# Altium schematic sheet connectors (1).SchDoc
size 431 x 279 mm; SheetNumber: 1; SheetTotal: 1
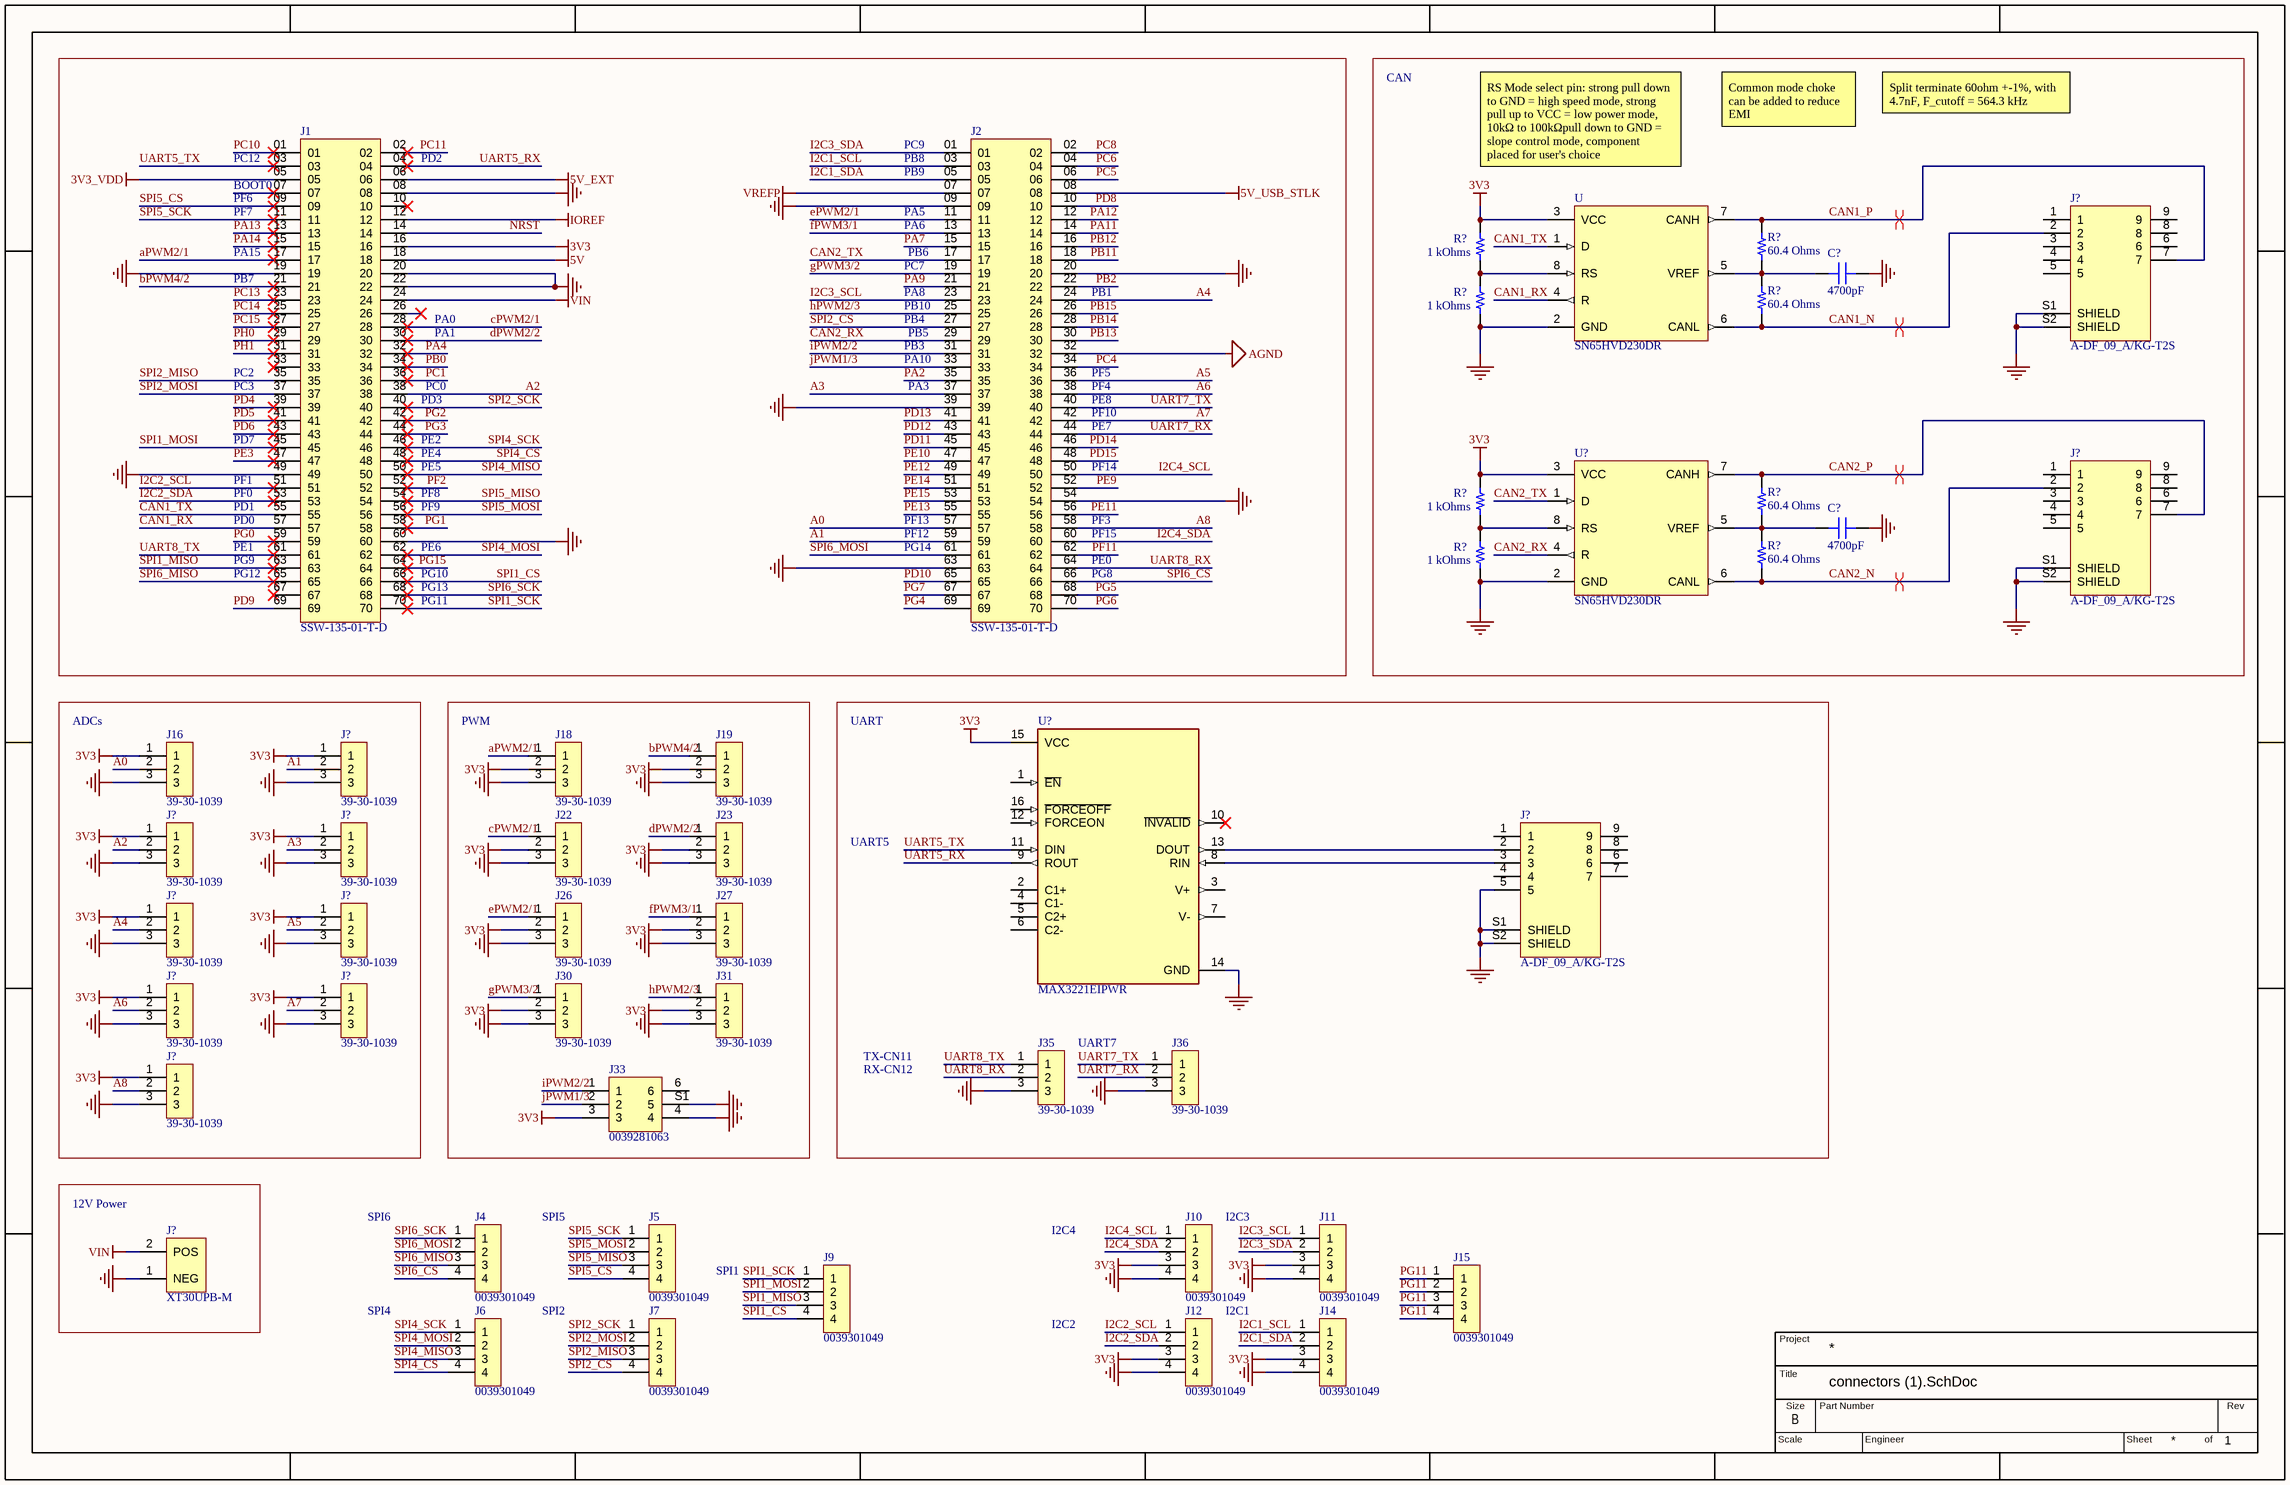
[diagram p0: connectors (1).SchDoc]

## Parts
(Parts that share a designator on the sheet are numbered #1, #2 ... from top to bottom, then left to right.)
C?#1  4700pF  [CAP 1206_3216 - 1.8MM]
C?#2  4700pF  [CAP 1206_3216 - 1.8MM]
J1  SSW-135-01-T-D  [SAMTEC_SSW-135-01-T-D]
J2  SSW-135-01-T-D  [SAMTEC_SSW-135-01-T-D]
J4  0039301049  [MOLEX_0039301049]
J5  0039301049  [MOLEX_0039301049]
J6  0039301049  [MOLEX_0039301049]
J7  0039301049  [MOLEX_0039301049]
J9  0039301049  [MOLEX_0039301049]
J10  0039301049  [MOLEX_0039301049]
J11  0039301049  [MOLEX_0039301049]
J12  0039301049  [MOLEX_0039301049]
J14  0039301049  [MOLEX_0039301049]
J15  0039301049  [MOLEX_0039301049]
J16  39-30-1039  [MOLEX_39-30-1039]
J18  39-30-1039  [MOLEX_39-30-1039]
J19  39-30-1039  [MOLEX_39-30-1039]
J22  39-30-1039  [MOLEX_39-30-1039]
J23  39-30-1039  [MOLEX_39-30-1039]
J26  39-30-1039  [MOLEX_39-30-1039]
J27  39-30-1039  [MOLEX_39-30-1039]
J30  39-30-1039  [MOLEX_39-30-1039]
J31  39-30-1039  [MOLEX_39-30-1039]
J33  0039281063  [MOLEX_0039281063]
J35  39-30-1039  [MOLEX_39-30-1039]
J36  39-30-1039  [MOLEX_39-30-1039]
J?#1  A-DF_09_A/KG-T2S  [ASSMANN_A-DF09A/KG-T2S]
J?#2  A-DF_09_A/KG-T2S  [ASSMANN_A-DF09A/KG-T2S]
J?#3  39-30-1039  [MOLEX_39-30-1039]
J?#4  39-30-1039  [MOLEX_39-30-1039]
J?#5  39-30-1039  [MOLEX_39-30-1039]
J?#6  A-DF_09_A/KG-T2S  [ASSMANN_A-DF09A/KG-T2S]
J?#7  39-30-1039  [MOLEX_39-30-1039]
J?#8  39-30-1039  [MOLEX_39-30-1039]
J?#9  39-30-1039  [MOLEX_39-30-1039]
J?#10  39-30-1039  [MOLEX_39-30-1039]
J?#11  39-30-1039  [MOLEX_39-30-1039]
J?#12  XT30UPB-M  [AMASS_XT30-M]
R?#1  1 kOhms  [RES 0805_2012]
R?#2  60.4 Ohms  [RES 0603_1608]
R?#3  1 kOhms  [RES 0805_2012]
R?#4  60.4 Ohms  [RES 0603_1608]
R?#5  1 kOhms  [RES 0805_2012]
R?#6  60.4 Ohms  [RES 0603_1608]
R?#7  1 kOhms  [RES 0805_2012]
R?#8  60.4 Ohms  [RES 0603_1608]
U  SN65HVD230DR  [SOIC127P599X175-8N]
U?#1  SN65HVD230DR  [SOIC127P599X175-8N]
U?#2  MAX3221EIPWR  [SOP65P640X120-16N]

## Blocks framed on the sheet
CAN: C?#1 C?#2 J?#1 J?#2 R?#1-R?#8 U U?#1
ADCs: J16 J?#3-J?#5 J?#7-J?#11
PWM: J18 J19 J22 J23 J26 J27 J30 J31 J33
12V Power: J?#12

## Nets
3V3: J1.16 J10.3 J11.3 J12.3 J14.3 J16.1 J18.2 J19.2 J22.2 J23.2 J26.2 J27.2 J30.2 J31.2 J33.3 J?#3.1 J?#4.1 J?#5.1 J?#7.1 J?#8.1 J?#9.1 J?#10.1 J?#11.1 R?#1.2 R?#5.2 U.3(VCC) U?#1.3(VCC) U?#2.15(VCC)
3V3_VDD: J1.05
5V: J1.18
5V_EXT: J1.06
5V_USB_STLK: J2.08
AGND: J2.32
GND: C?#1.2 C?#2.2 J1.08 J1.19 J1.20 J1.22 J1.49 J1.60 J2.09 J2.20 J2.39 J2.54 J2.63 J10.4 J11.4 J12.4 J14.4 J16.3 J18.3 J19.3 J22.3 J23.3 J26.3 J27.3 J30.3 J31.3 J33.4 J33.S1(5) J35.3 J36.3 J?#1.S1(SHIELD) J?#1.S2(SHIELD) J?#2.S1(SHIELD) J?#2.S2(SHIELD) J?#3.3 J?#4.3 J?#5.3 J?#6.5 J?#6.S1(SHIELD) J?#6.S2(SHIELD) J?#7.3 J?#8.3 J?#9.3 J?#10.3 J?#11.3 J?#12.1(NEG) R?#3.1 R?#7.1 U.2(GND) U?#1.2(GND) U?#2.14(GND)
IOREF: J1.12
VIN: J1.24 J?#12.2(POS)
VREFP: J2.07
A0: J2.57 J16.2
A1: J2.59 J?#3.2
A2: J1.38 J?#4.2
A3: J2.37 J?#5.2
A4: J2.24 J?#7.2
A5: J2.36 J?#8.2
A6: J2.38 J?#9.2
A7: J2.42 J?#10.2
A8: J2.58 J?#11.2
aPWM2/1: J1.17 J18.1
bPWM4/2: J1.21 J19.1
CAN1_N: J?#1.2 R?#4.2 U.6(CANL)
CAN1_P: J?#1.7 R?#2.1 U.7(CANH)
CAN1_RX: J1.57 U.4(R)
CAN1_TX: J1.55 U.1(D)
CAN2_N: J?#2.2 R?#8.2 U?#1.6(CANL)
CAN2_P: J?#2.7 R?#6.1 U?#1.7(CANH)
CAN2_RX: J2.29 U?#1.4(R)
CAN2_TX: J2.17 U?#1.1(D)
cPWM2/1: J1.28 J22.1
dPWM2/2: J1.30 J23.1
ePWM2/1: J2.11 J26.1
fPWM3/1: J2.13 J27.1
gPWM3/2: J2.19 J30.1
hPWM2/3: J2.25 J31.1
I2C1_SCL: J2.03 J14.1
I2C1_SDA: J2.05 J14.2
I2C2_SCL: J1.51 J12.1
I2C2_SDA: J1.53 J12.2
I2C3_SCL: J2.23 J11.1
I2C3_SDA: J2.01 J11.2
I2C4_SCL: J2.50 J10.1
I2C4_SDA: J2.60 J10.2
iPWM2/2: J2.31 J33.1
jPWM1/3: J2.33 J33.2
NRST: J1.14
PA2: J2.35
PA4: J1.32
PA7: J2.15
PA9: J2.21
PA11: J2.14
PA12: J2.12
PA13: J1.13
PA14: J1.15
PB0: J1.34
PB2: J2.22
PB11: J2.18
PB12: J2.16
PB13: J2.30
PB14: J2.28
PB15: J2.26
PC1: J1.36
PC4: J2.34
PC5: J2.06
PC6: J2.04
PC8: J2.02
PC10: J1.01
PC11: J1.02
PC13: J1.23
PC14: J1.25
PC15: J1.27
PD4: J1.39
PD5: J1.41
PD6: J1.43
PD8: J2.10
PD9: J1.69
PD10: J2.65
PD11: J2.45
PD12: J2.43
PD13: J2.41
PD14: J2.46
PD15: J2.48
PE3: J1.47
PE9: J2.52
PE10: J2.47
PE11: J2.56
PE12: J2.49
PE13: J2.55
PE14: J2.51
PE15: J2.53
PF2: J1.52
PF11: J2.62
PG0: J1.59
PG1: J1.58
PG2: J1.42
PG3: J1.44
PG4: J2.69
PG5: J2.68
PG6: J2.70
PG7: J2.67
PG11: J15.1 J15.2 J15.3 J15.4
PG15: J1.64
PH0: J1.29
PH1: J1.31
SPI1_CS: J1.66 J9.4
SPI1_MISO: J1.63 J9.3
SPI1_MOSI: J1.45 J9.2
SPI1_SCK: J1.70 J9.1
SPI2_CS: J2.27 J7.4
SPI2_MISO: J1.35 J7.3
SPI2_MOSI: J1.37 J7.2
SPI2_SCK: J1.40 J7.1
SPI4_CS: J1.48 J6.4
SPI4_MISO: J1.50 J6.3
SPI4_MOSI: J1.62 J6.2
SPI4_SCK: J1.46 J6.1
SPI5_CS: J1.09 J5.4
SPI5_MISO: J1.54 J5.3
SPI5_MOSI: J1.56 J5.2
SPI5_SCK: J1.11 J5.1
SPI6_CS: J2.66 J4.4
SPI6_MISO: J1.65 J4.3
SPI6_MOSI: J2.61 J4.2
SPI6_SCK: J1.68 J4.1
UART5_RX: J1.04 U?#2.9(ROUT)
UART5_TX: J1.03 U?#2.11(DIN)
UART7_RX: J2.44 J36.2
UART7_TX: J2.40 J36.1
UART8_RX: J2.64 J35.2
UART8_TX: J1.61 J35.1
NetC?#1_1: C?#1.1 R?#2.2 R?#4.1 U.5(VREF)
NetC?#2_1: C?#2.1 R?#6.2 R?#8.1 U?#1.5(VREF)
NetJ?#6_2: J?#6.2 U?#2.13(DOUT)
NetJ?#6_3: J?#6.3 U?#2.8(RIN)
NetR?#1_1: R?#1.1 R?#3.2 U.8(RS)
NetR?#5_1: R?#5.1 R?#7.2 U?#1.8(RS)

Not connected (* = marked no-connect by the designer): J1 07* 10* 26* 33* 67*; J33 6; J?#1 1 3 4 5 6 8 9; J?#2 1 3 4 5 6 8 9; J?#6 1 4 6 7 8 9; U?#2 1(~{EN}) 2(C1+) 3(V+) 4(C1-) 5(C2+) 6(C2-) 7(V-) 10(~{INVALID})* 12(FORCEON) 16(~{FORCEOFF})

## Layout directives
differential pair: CAN1_N, CAN1_P, CAN2_N, CAN2_P

## Notes on the sheet
- (near J1) PC12
- (near J1) PD2
- (near J2) PC9
- (near J2) PB8
- RS Mode select pin: strong pull down to GND = high speed mode, strong
  pull up to VCC = low power mode, 10kΩ to 100kΩpull down to GND = slope control mode, component placed for user's choice
- Common mode choke can be added to reduce EMI
- Split terminate 60ohm +-1%, with 4.7nF, F_cutoff = 564.3 kHz
- (near J1) BOOT0
- (near J1) PF6
- (near J1) PF7
- (near J2) PA5
- (near J2) PA6
- (near J2) PB9
- (near J1) PB7
- (near J1) PA15
- (near J2) PC7
- (near J2) PA8
- (near J2) PB6
- (near J2) PB1
- PA0
- PA1
- (near J2) PB10
- (near J2) PB3
- (near J2) PA10
- (near J2) PB4
- (near J2) PB5
- (near J1) PC3
- (near J1) PC2
- (near J1) PD3
- (near J1) PC0
- (near J2) PA3
- (near J2) PF5
- (near J2) PF10
- (near J2) PF4
- (near J2) PE8
- (near J2) PE7
- (near J1) PD7
- (near J1) PF1
- (near J1) PF0
- (near J1) PF8
- (near J1) PE2
- (near J1) PE4
- (near J1) PE5
- (near J2) PF14
- (near J1) PD0
- (near J1) PD1
- (near J1) PE1
- (near J1) PG9
- (near J1) PF9
- (near J1) PE6
- (near J2) PG14
- (near J2) PF13
- (near J2) PF12
- (near J2) PF3
- (near J2) PE0
- (near J2) PF15
- (near J1) PG12
- (near J1) PG13
- (near J1) PG10
- (near J1) PG11
- (near J2) PG8
- UART
- UART5
- TX-CN11
- RX-CN12
- UART7
- SPI6
- SPI5
- I2C4
- (near J10) I2C3
- SPI1
- SPI4
- SPI2
- I2C2
- I2C1
- Title
- Project
- Scale
- Size
- B
- Part Number
- Engineer
- Sheet
- of
- Rev

## Library data of the parts
C?#1 C?#2 = C3216X7R2J472K115AA: CAP CER 4700PF 630V X7R 1206; Manufacturer: TDK Corporation; Tolerance: ±10%; Part Number: C3216X7R2J472K115AA; Value: 4700pF; Applications: General Purpose; Capacitance: 4700pF; ComponentLink1Description: Datasheet; ComponentLink1URL: https://product.tdk.com/info/en/catalog/datasheets/mlcc_commercial_midvoltage_en.pdf?ref_disty=digikey; ComponentLink2Description: DigiKey Link; ComponentLink2URL: http://digikey.com/product-detail/en/tdk-corporation/C3216X7R2J472K115AA/445-2290-1-ND/789799; Device Package: 1206 (3216 Metric); LastUpdated: 9/2/2020 1:05:27 AM; Lifecycle Status: Active; Minimum Order: 1; Mounting Type: Surface Mount, MLCC; Operating Temperature: -55°C ~ 125°C; Package / Case: 1206 (3216 Metric); Packaging: TapeAndReel; PartId: 22335; Part Status: Active; Price: 0.06; Series: C; Size / Dimension: 0.126" L x 0.063" W (3.20mm x 1.60mm); Supplier 1: DigiKey; Supplier Part Number 1: 445-2290-1-ND; Temperature Coefficient: X7R; Thickness (Max): 0.051" (1.30mm); Voltage - Rated: 630V
J1 J2 = SSW-135-01-T-D: MF: Samtec; Value: *; Price: None; Package: None; Availability: Unavailable; MP: SSW-135-01-T-D
J4-J7 J9-J12 J14 J15 = 0039301049: Connector Header Through Hole 4 position 0.165 _4.20mm_; MF: Molex; Value: *; Package: None; Price: None; SnapEDA_Link: https://www.snapeda.com/parts/0039301049/Molex/view-part/104320/?ref=snap; Availability: Unavailable; MP: 0039301049
J16 J18 J19 J22 J23 J26 J27 J30 J31 J35 J36 J?#3-J?#5 J?#7-J?#11 = 39-30-1039: Connector Header Through Hole 3 position 0.165 _4.20mm_; MP: 39301039; MF: Molex; Price: None; Value: *; Package: None; SnapEDA_Link: https://www.snapeda.com/parts/39301039/Molex/view-part/1160208/?ref=snap; Availability: Unavailable
J33 = 0039281063: Connector Header Through Hole, 6 position 0.165 (4.20mm); MP: 0026013115; MF: Molex; Package: None; DigiKey-Purchase-URL: https://snapeda.com/shop?store=DigiKey&id=2597941; Value: *; SnapEDA_Link: https://www.snapeda.com/parts/0026013115/Molex/view-part/2597941/?ref=snap; Price: None; Availability: Unavailable
J?#1 J?#2 J?#6 = A-DF_09_A/KG-T2S: 9 Position D-Sub Receptacle, Female Sockets Connector; MP: A-DF 09 A/KG-T2S; MF: Assmann WSW; SnapEDA_Link: https://www.snapeda.com/parts/A-DF%2009%20A/KG-T2S/Assmann%20WSW%20Components/view-part/2761262/?ref=snap; Availability: Unavailable; Check_prices: https://www.snapeda.com/parts/A-DF%2009%20A/KG-T2S/Assmann%20WSW%20Components/view-part/2761262/?ref=eda; Price: None; Value: *; Package: None
J?#12 = XT30UPB-M: Plug; DC supply; XT60; male; PIN: 2; for cable; soldered; 30A; 500V; MP: XT60-M; MF: AMASS; Price: None; Package: Package Analog Devices; Value: *; Availability: Unavailable; SnapEDA_Link: https://www.snapeda.com/parts/XT60-M/AMASS/view-part/2883912/?ref=snap
R?#1 R?#3 R?#5 R?#7 = RNCP0805FTD1K00: RES 1K OHM 1% 1/4W 0805; Manufacturer: Stackpole Electronics Inc; Power (Watts): 0.25W, 1/4W; Temperature Coefficient: ±100ppm/°C; Part Number: RNCP0805FTD1K00; Value: 1 kOhms; ComponentLink1Description: Datasheet; ComponentLink1URL: https://www.seielect.com/catalog/sei-rncp.pdf; ComponentLink2Description: DigiKey Link; ComponentLink2URL: http://digikey.com/product-detail/en/stackpole-electronics-inc/RNCP0805FTD1K00/RNCP0805FTD1K00CT-ND/2240568; Composition: Thin Film; Device Package: 0805 (2012 Metric); Features: Anti-Sulfur, Moisture Resistant; Height - Seated (Max): 0.024" (0.60mm); LastUpdated: 9/2/2020 1:15:23 AM; Lifecycle Status: Active; Minimum Order: 1; Number of Terminations: 2; Operating Temperature: -55°C ~ 155°C; Package / Case: 0805 (2012 Metric); Packaging: TapeAndReel; PartId: 28023; Part Status: Active; Price: 0.01; Resistance: 1 kOhms; Series: RNCP; Size / Dimension: 0.079" L x 0.049" W (2.00mm x 1.25mm); Supplier 1: DigiKey; Supplier Part Number 1: RNCP0805FTD1K00CT-ND; Supplier Device Package: 0805; Tolerance: ±1%
R?#2 R?#4 R?#6 R?#8 = RMCF0603FT60R4: RES 60.4 OHM 1% 1/10W 0603; Manufacturer: Stackpole Electronics Inc; Power (Watts): 0.1W, 1/10W; Temperature Coefficient: ±100ppm/°C; Part Number: RMCF0603FT60R4; Value: 60.4 Ohms; ComponentLink1Description: Datasheet; ComponentLink1URL: https://www.seielect.com/catalog/sei-rmcf_rmcp.pdf; ComponentLink2Description: DigiKey Link; ComponentLink2URL: http://digikey.com/product-detail/en/stackpole-electronics-inc/RMCF0603FT60R4/RMCF0603FT60R4CT-ND/2418105; Composition: Thick Film; Device Package: 0603 (1608 Metric); Features: Automotive AEC-Q200; Height - Seated (Max): 0.022" (0.55mm); LastUpdated: 9/2/2020 1:10:13 AM; Lifecycle Status: Active; Minimum Order: 1; Number of Terminations: 2; Operating Temperature: -55°C ~ 155°C; Package / Case: 0603 (1608 Metric); Packaging: CutTape; PartId: 10803; Part Status: Active; Price: 0.10; Ratings: AEC-Q200; Resistance: 60.4 Ohms; Series: RMCF; Size / Dimension: 0.061" L x 0.031" W (1.55mm x 0.80mm); Supplier 1: DigiKey; Supplier Part Number 1: RMCF0603FT60R4CT-ND; Supplier Device Package: 0603; Tolerance: ±1%
U U?#1 = SN65HVD230DR: 3.3 V CAN Transceiver with Standby Mode 8-SOIC -40 to 85; MF: Texas Instruments; Package: SOIC-8 Texas Instruments; DigiKey-Purchase-URL: https://snapeda.com/shop?store=DigiKey&id=51767; MP: SN65HVD230DR; Mouser-Purchase-URL: https://snapeda.com/shop?store=Mouser&id=51767; Value: *; Arrow_Electronics-Purchase-URL: https://snapeda.com/shop?store=Arrow+Electronics&id=51767; Availability: Good; SnapEDA_Link: https://www.snapeda.com/parts/SN65HVD230DR/Texas%20Instruments/view-part/51767/?ref=snap; Price: None; Texas_Instruments-Purchase-URL: https://snapeda.com/shop?store=Texas+Instruments&id=51767
U?#2 = MAX3221EIPWR: 3-V to 5.5-V Single-Channel RS-232 Line Driver/Receiver 16-TSSOP 0 to 70; Value: *; Availability: Unavailable; Package: None; MP: MAX3221EIPWR; Price: None